# EAGLE design mega_shield_1_1 (EAGLE 7.5.0)
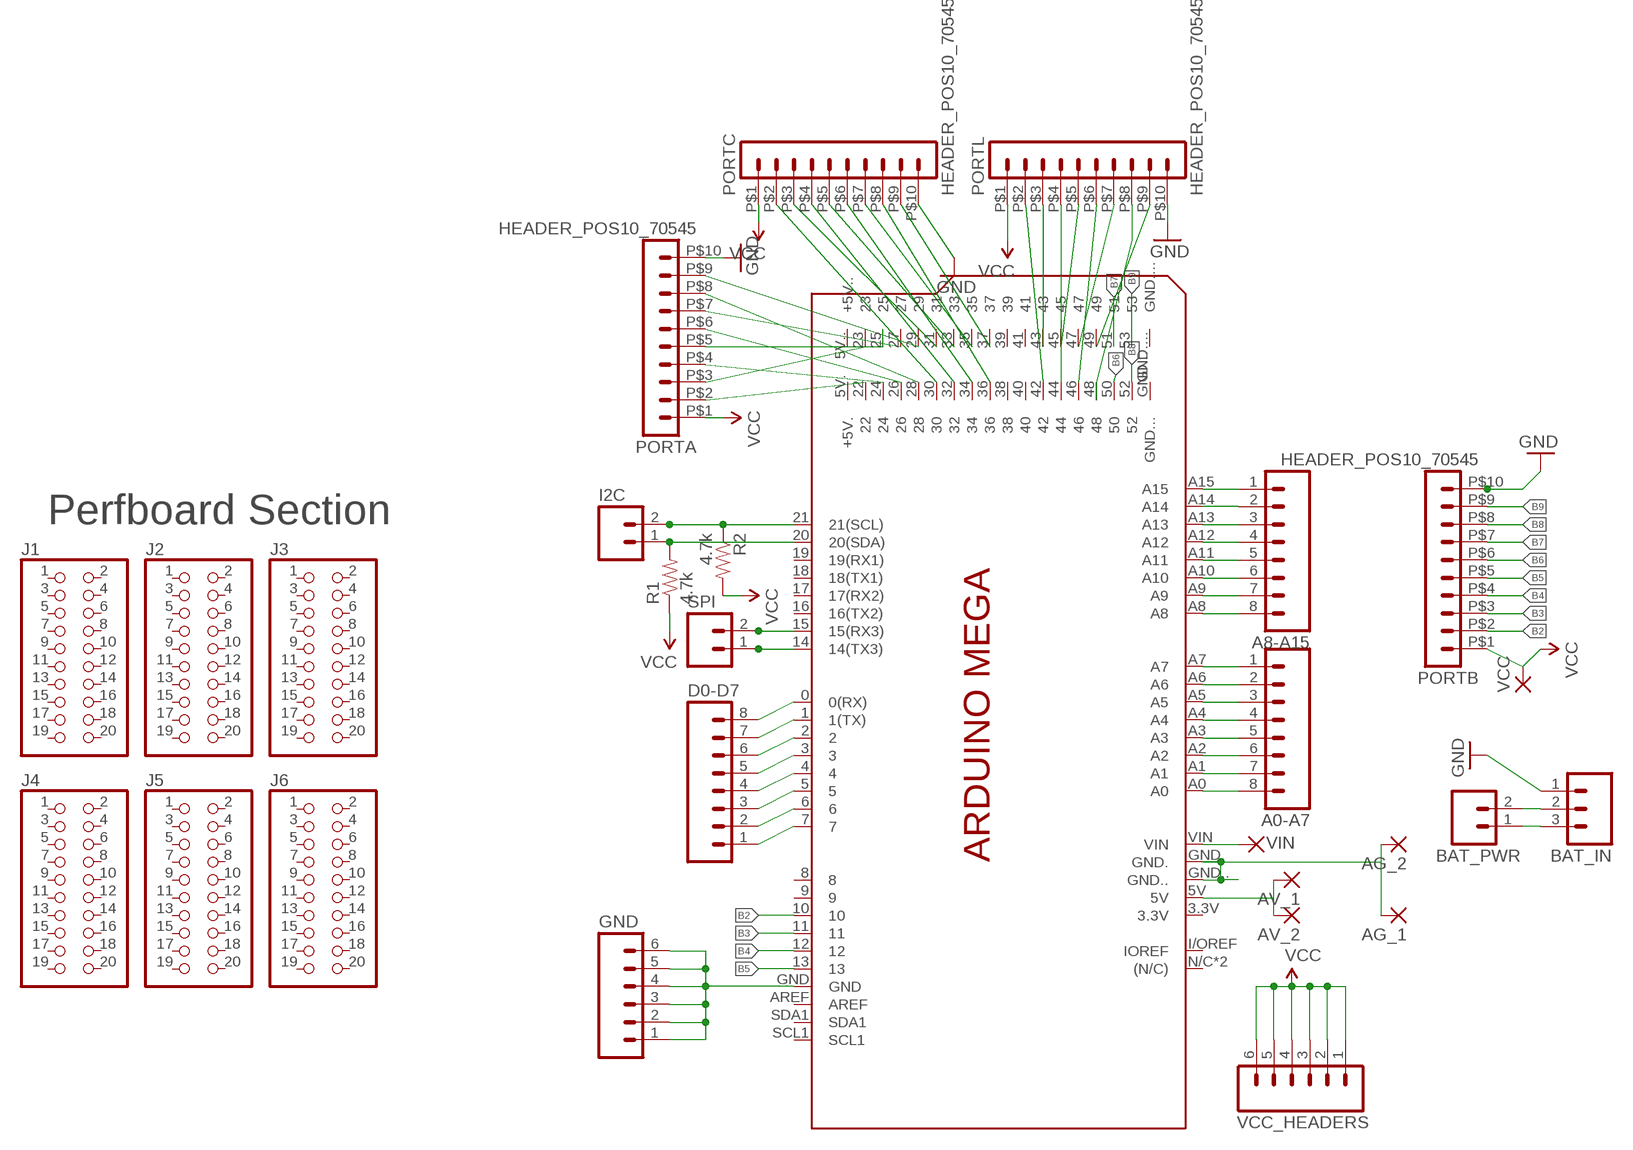
[diagram p0: schematic, sheet 1]

## Parts
A0-A7  M08  [1X08_ROUND]
A8-A15  M08  [1X08_ROUND]
AG_1  2,54/1,0  [2,54/1,0]
AG_2  2,54/1,0  [2,54/1,0]
AV_1  2,54/1,0  [2,54/1,0]
AV_2  2,54/1,0  [2,54/1,0]
BAT_IN  M03POLAR  [MOLEX-1X3]
BAT_PWR  M021X02_NO_SILK  [1X02_NO_SILK]
D0-D7  M08  [1X08_ROUND]
GND  M06SILK_FEMALE_PTH  [1X06]
I2C  M02PTH  [1X02]
J1  PINHD-2X10  [2X10]
J2  PINHD-2X10  [2X10]
J3  PINHD-2X10  [2X10]
J4  PINHD-2X10  [2X10]
J5  PINHD-2X10  [2X10]
J6  PINHD-2X10  [2X10]
PCB1  ARDUINO_MEGA  [ARDUINO_MEGA]
PORTA  HEADER_POS10_70545  [70545-POS10]
PORTB  HEADER_POS10_70545  [70545-POS10]
PORTC  HEADER_POS10_70545  [70545-POS10]
PORTL  HEADER_POS10_70545  [70545-POS10]
R1  4.7k  RESISTORPTH1  [AXIAL-0.3]
R2  4.7k  RESISTORPTH1  [AXIAL-0.3]
SPI  M02PTH  [1X02]
VCC  2,54/0,9  [2,54/0,9]
VCC_HEADERS  M06SILK_FEMALE_PTH  [1X06]
VIN  2,54/1,0  [2,54/1,0]

## Nets
B2: PCB1.10 PORTB.P$2
B3: PCB1.11 PORTB.P$3
B4: PCB1.12 PORTB.P$4
B5: PCB1.13 PORTB.P$5
B6: PCB1.50 PORTB.P$6
B7: PCB1.51 PORTB.P$7
B8: PCB1.52 PORTB.P$8
B9: PCB1.53 PORTB.P$9
GND: BAT_IN.1 PORTA.P$10 PORTB.P$10 PORTC.P$10 PORTL.P$10
GND_PI: AG_1.1(P) AG_2.1(P) PCB1.GND. PCB1.GND..
N$1: PCB1.22 PORTA.P$2
N$2: PCB1.23 PORTA.P$3
N$3: PCB1.24 PORTA.P$4
N$4: PCB1.25 PORTA.P$5
N$5: PCB1.26 PORTA.P$6
N$6: PCB1.27 PORTA.P$7
N$7: PCB1.28 PORTA.P$8
N$8: PCB1.29 PORTA.P$9
N$9: PCB1.14(14(TX3)) SPI.1
N$10: PCB1.15(15(RX3)) SPI.2
N$11: PCB1.30 PORTC.P$2
N$12: PCB1.31 PORTC.P$3
N$13: PCB1.32 PORTC.P$4
N$14: PCB1.33 PORTC.P$5
N$15: PCB1.34 PORTC.P$6
N$16: PCB1.35 PORTC.P$7
N$17: PCB1.36 PORTC.P$8
N$18: PCB1.37 PORTC.P$9
N$19: PCB1.42 PORTL.P$2
N$20: PCB1.43 PORTL.P$3
N$21: PCB1.44 PORTL.P$4
N$22: PCB1.45 PORTL.P$5
N$23: PCB1.46 PORTL.P$6
N$24: PCB1.47 PORTL.P$7
N$25: PCB1.49 PORTL.P$9
N$26: BAT_IN.2 BAT_PWR.2
N$27: A0-A7.1 PCB1.A7
N$28: A0-A7.2 PCB1.A6
N$29: PCB1.48 PORTL.P$8
N$30: A0-A7.3 PCB1.A5
N$31: A0-A7.4 PCB1.A4
N$32: A0-A7.5 PCB1.A3
N$33: A0-A7.6 PCB1.A2
N$34: A0-A7.7 PCB1.A1
N$35: I2C.1 PCB1.20(20(SDA)) R1.P$2
N$36: I2C.2 PCB1.21(21(SCL)) R2.P$1
N$37: A0-A7.8 PCB1.A0
N$38: A8-A15.8 PCB1.A8
N$39: A8-A15.7 PCB1.A9
N$40: A8-A15.6 PCB1.A10
N$41: A8-A15.5 PCB1.A11
N$42: A8-A15.4 PCB1.A12
N$43: A8-A15.3 PCB1.A13
N$44: A8-A15.2 PCB1.A14
N$45: A8-A15.1 PCB1.A15
N$46: D0-D7.1 PCB1.7
N$47: D0-D7.2 PCB1.6
N$48: D0-D7.3 PCB1.5
N$49: D0-D7.4 PCB1.4
N$50: D0-D7.5 PCB1.3
N$51: D0-D7.6 PCB1.2
N$52: D0-D7.7 PCB1.1(1(TX))
N$53: D0-D7.8 PCB1.0(0(RX))
N$54: GND.1 GND.2 GND.3 GND.4 GND.5 GND.6 PCB1.GND
N$55: AV_1.1(P) AV_2.1(P) PCB1.5V
N$56: BAT_IN.3 BAT_PWR.1
VCC: PORTA.P$1 PORTB.P$1 PORTC.P$1 PORTL.P$1 R1.P$1 R2.P$2 VCC.1(P) VCC_HEADERS.1 VCC_HEADERS.2 VCC_HEADERS.3 VCC_HEADERS.4 VCC_HEADERS.5 VCC_HEADERS.6
VIN: PCB1.VIN VIN.1(P)
Unconnected: J1.1 J1.2 J1.3 J1.4 J1.5 J1.6 J1.7 J1.8 J1.9 J1.10 J1.11 J1.12 J1.13 J1.14 J1.15 J1.16 J1.17 J1.18 J1.19 J1.20 J2.1 J2.2 J2.3 J2.4 J2.5 J2.6 J2.7 J2.8 J2.9 J2.10 J2.11 J2.12 J2.13 J2.14 J2.15 J2.16 J2.17 J2.18 J2.19 J2.20 J3.1 J3.2 J3.3 J3.4 J3.5 J3.6 J3.7 J3.8 J3.9 J3.10 J3.11 J3.12 J3.13 J3.14 J3.15 J3.16 J3.17 J3.18 J3.19 J3.20 J4.1 J4.2 J4.3 J4.4 J4.5 J4.6 J4.7 J4.8 J4.9 J4.10 J4.11 J4.12 J4.13 J4.14 J4.15 J4.16 J4.17 J4.18 J4.19 J4.20 J5.1 J5.2 J5.3 J5.4 J5.5 J5.6 J5.7 J5.8 J5.9 J5.10 J5.11 J5.12 J5.13 J5.14 J5.15 J5.16 J5.17 J5.18 J5.19 J5.20 J6.1 J6.2 J6.3 J6.4 J6.5 J6.6 J6.7 J6.8 J6.9 J6.10 J6.11 J6.12 J6.13 J6.14 J6.15 J6.16 J6.17 J6.18 J6.19 J6.20 PCB1.3.3V PCB1.5V.(+5V.) PCB1.5V..(+5V..) PCB1.8 PCB1.9 PCB1.16(16(TX2)) PCB1.17(17(RX2)) PCB1.18(18(TX1)) PCB1.19(19(RX1)) PCB1.38 PCB1.39 PCB1.40 PCB1.41 PCB1.AREF PCB1.GND... PCB1.GND.... PCB1.I/OREF(IOREF) PCB1.N/C((N/C)) PCB1.RESET((N/C)) PCB1.SCL1 PCB1.SDA1

## Notes on the sheet
- Perfboard Section

## Library data of the parts
A0-A7 A8-A15 D0-D7 = SparkFun-Connectors:M08: Header 8 Standard 8-pin 0.1" header. Use with straight break away headers (SKU : PRT-00116), right angle break away headers (PRT-00553), swiss pins (PRT-00743), machine pins (PRT-00117), and female headers (PRT-00115).; PROD_ID: CONN-08437
AG_1 AG_2 AV_1 AV_2 VIN = wirepad:2,54/1,0: THROUGH-HOLE PAD
BAT_IN = SparkFun-Connectors:M03: Header 3 Standard 3-pin 0.1" header. Use with straight break away headers (SKU : PRT-00116), right angle break away headers (PRT-00553), swiss pins (PRT-00743), machine pins (PRT-00117), and female headers (PRT-00115). Molex polarized connector foot print use with SKU : PRT-08232 with associated crimp pins and housings.
BAT_PWR = SparkFun-Connectors:M02: Standard 2-pin 0.1" header. Use with - straight break away headers ( PRT-00116) - right angle break away headers (PRT-00553) - swiss pins (PRT-00743) - machine pins (PRT-00117) - female headers (PRT-00115) Molex polarized connector foot print use with: PRT-08233 with associated crimp pins and housings. 2.54_SCREWTERM for use with PRT-10571. 3.5mm Screw Terminal footprints for PRT-08084 5mm Screw Terminal footprints for use with PRT-08432
GND VCC_HEADERS = SparkFun-Connectors:M06: Header 6 Standard 6-pin 0.1" header. Use with straight break away headers (SKU : PRT-00116), right angle break away headers (PRT-00553), swiss pins (PRT-00743), machine pins (PRT-00117), and female headers (PRT-00115). Molex polarized connector foot print use with SKU : PRT-08094 with associated crimp pins and housings. NOTES ON THE VARIANTS LOCK and LOCK_LONGPADS... This footprint was designed to help hold the alignment of a through-hole component (i.e. 6-pin header) while soldering it into place. You may notice that each hole has been shifted either up or down by 0.005 of an inch from it's more standard position (which is a perfectly straight line). This slight alteration caused the pins (the squares in the middle) to touch the edges of the holes. Because they are alternating, it causes a "brace" to hold the component in place. 0.005 has proven to be the perfect amount of "off-center" position when using our standard breakaway headers. Although looks a little odd when you look at the bare footprint, once you have a header in there, the alteration is very hard to notice. Also,if you push a header all the way into place, it is covered up entirely on the bottom side. This idea of altering the position of holes to aid alignment will be further integrated into the Sparkfun Library for other footprints. It can help hold any component with 3 or more connection pins.; PROD_ID: CONN-08437
I2C SPI = SparkFun:M02: Header 2 Standard 2-pin 0.1" header. Use with straight break away headers (SKU : PRT-00116), right angle break away headers (PRT-00553), swiss pins (PRT-00743), machine pins (PRT-00117), and female headers (PRT-00115). Molex polarized connector foot print use with SKU : PRT-08233 with associated crimp pins and housings.
J1-J6 = SparkFun-Connectors:PINHD-2X10: PIN HEADER
PCB1 = Nathans_Arduinos:ARDUINO_MEGA: Device for representing an Arduino Mega board with a footprint in an EAGLE design. Created by Dave Young for Element14. More EAGLE documentation at: http://www.element14.com/community/community/knode/cadsoft_eagle
PORTA PORTB PORTC PORTL = con-molex-c-grid-sl:HEADER_POS10_?: Molex -C-Grid® / SL Series connector Wire-to-Board 2.54 mm (0.100") pitch header, 10 positions.
R1 R2 = SparkFun:RESISTOR: Resistor Basic schematic elements and footprints for 0603, 1206, and PTH 1/10th watt (small) resistors.
VCC = wirepad:2,54/0,9: THROUGH-HOLE PAD

## Net classes
0 default: width 0.178 mm, drill 0.254 mm, clearance 0.178 mm
1 VCC: width 0.381 mm, drill 0.406 mm, clearance 0.305 mm

## Board
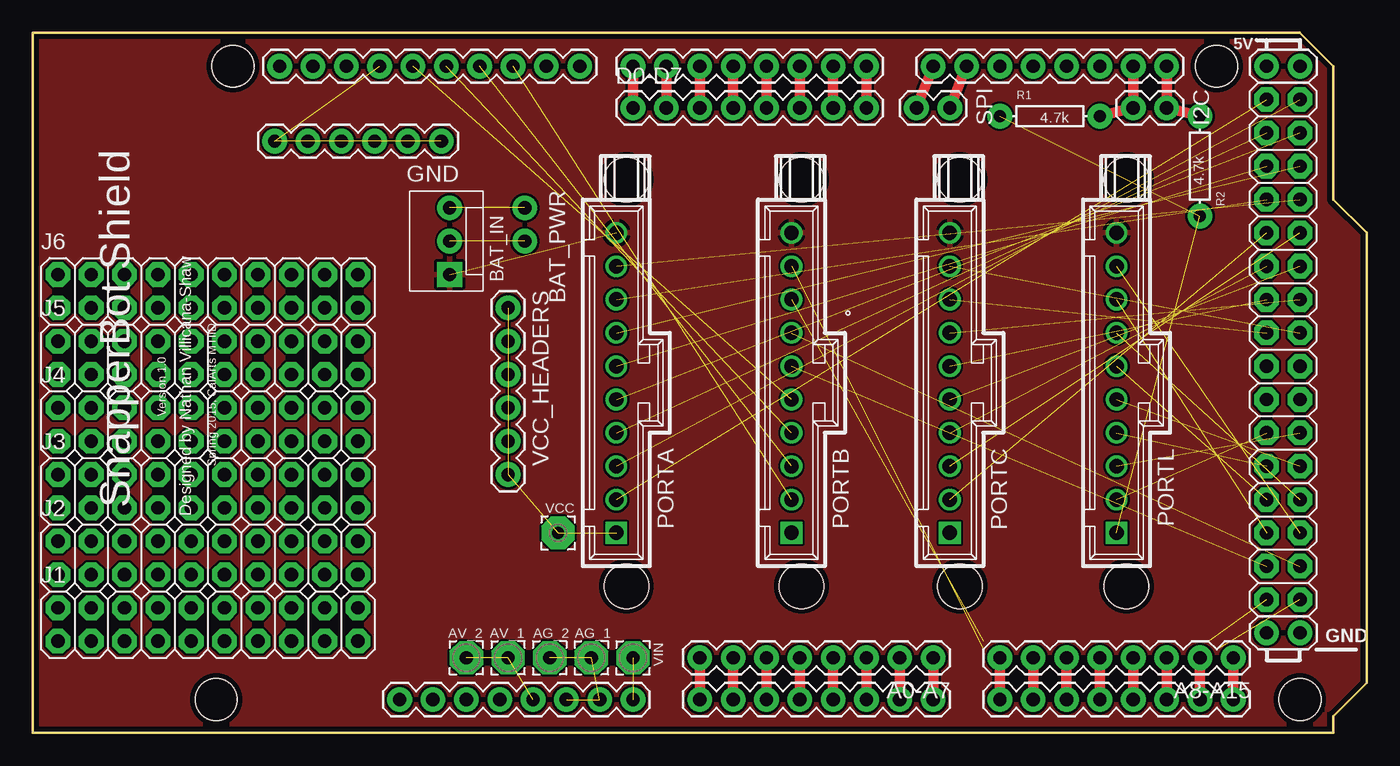
[diagram p1: board, top side]
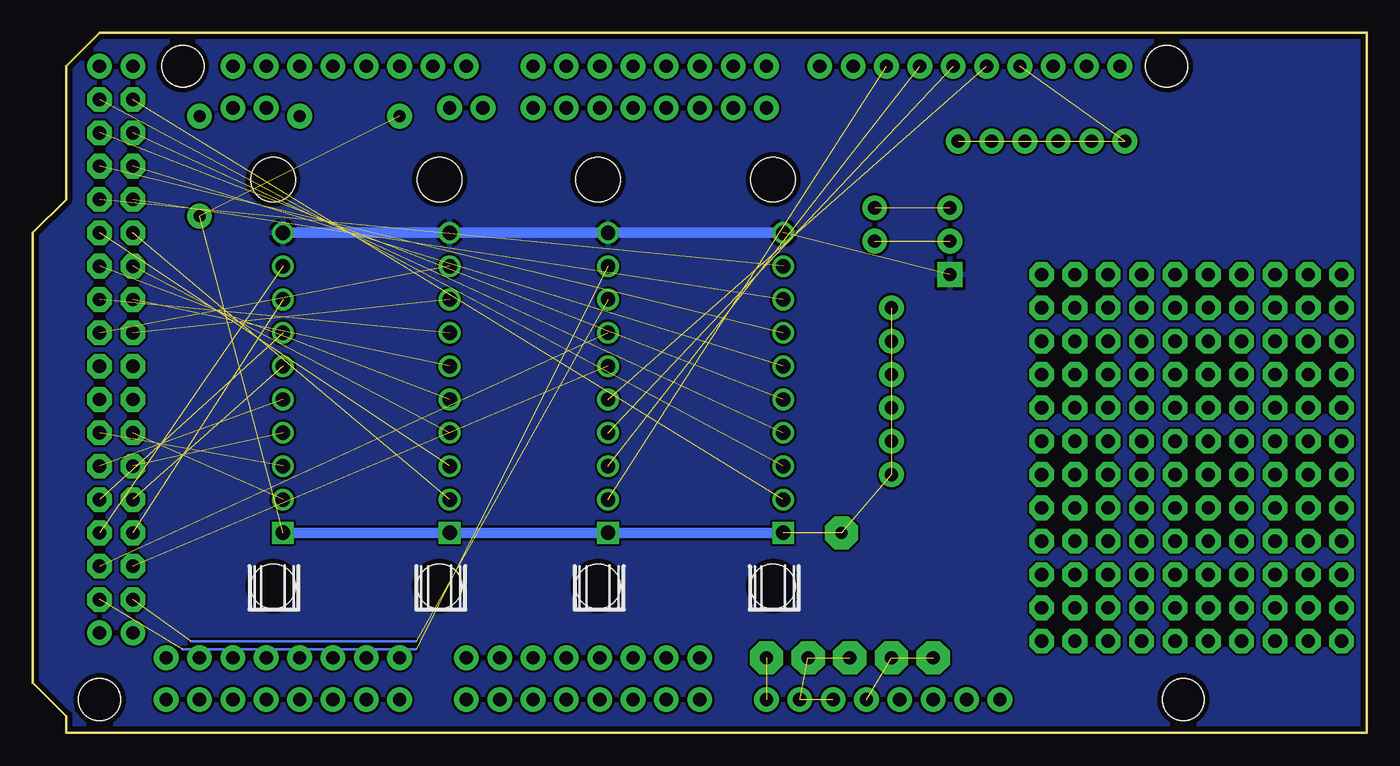
[diagram p2: board, bottom side, seen from below]

Size 101.6 x 53.34 mm. Coordinates in mm from the lower left corner, seen from the top.
Outline: 0,0 99.06,0 99.06,1.27 101.6,3.81 101.6,38.1 99.06,40.64 99.06,50.8 96.52,53.34 0,53.34 0,0
Copper layers (1*16): Top 0.0356mm / dielectric 1.5011mm / Bottom 0.0356mm
Design rules "oshPark": minimum track width 6mil, minimum drill 13mil, track to track 6mil, track to pad 6mil, pad to pad 6mil, via to via 6mil, smd to smd 6mil, copper to edge 15mil, drill to drill 6mil, minimum pad ring 7mil, minimum via ring 7mil, stop-mask expansion 3mil, vias tented up to drill 0mil, thermal gap 10mil

### Footprints (pad centres in the part's own frame; a part is rotated, then mirrored left to right if it is on the bottom)
1X08_ROUND = drill 1.016 pad 1.88: 1 0,0; 2 2.54,0; 3 5.08,0; 4 7.62,0; 5 10.16,0; 6 12.7,0; 7 15.24,0; 8 17.78,0
2,54/1,0 = drill 1.016 pad 2.54 octagon: 1 0,0
MOLEX-1X3 = drill 1.016 pad 1.88 square: 1 0,0 | drill 1.016 pad 1.88: 2 2.54,0; 3 5.08,0
1X02_NO_SILK = drill 1.016 pad 1.88: 1 0,0; 2 2.54,0
1X06 = drill 1.016 pad 1.88: 1 0,0; 2 2.54,0; 3 5.08,0; 4 7.62,0; 5 10.16,0; 6 12.7,0
1X02 = drill 1.016 pad 1.88: 1 0,0; 2 2.54,0
2X10 = drill 1.016 pad 1.88 octagon: 1 -11.43,-1.27; 2 -11.43,1.27; 3 -8.89,-1.27; 4 -8.89,1.27; 5 -6.35,-1.27; 6 -6.35,1.27; 7 -3.81,-1.27; 8 -3.81,1.27; 9 -1.27,-1.27; 10 -1.27,1.27; 11 1.27,-1.27; 12 1.27,1.27; 13 3.81,-1.27; 14 3.81,1.27; 15 6.35,-1.27; 16 6.35,1.27; 17 8.89,-1.27; 18 8.89,1.27; 19 11.43,-1.27; 20 11.43,1.27
ARDUINO_MEGA = drill 1.016 pad 1.88: 0 63.5,50.8; 1 60.96,50.8; 2 58.42,50.8; 3 55.88,50.8; 3.3V 35.56,2.54; 4 53.34,50.8; 5 50.8,50.8; 5V 38.1,2.54; 5V. 93.98,50.8; 5V.. 96.52,50.8; 6 48.26,50.8; 7 45.72,50.8; 8 41.656,50.8; 9 39.116,50.8; 10 36.576,50.8; 11 34.036,50.8; 12 31.496,50.8; 13 28.956,50.8; 14 68.58,50.8; 15 71.12,50.8; 16 73.66,50.8; 17 76.2,50.8; 18 78.74,50.8; 19 81.28,50.8; 20 83.82,50.8; 21 86.36,50.8; A0 50.8,2.54; A1 53.34,2.54; A2 55.88,2.54; A3 58.42,2.54; A4 60.96,2.54; A5 63.5,2.54; A6 66.04,2.54; A7 68.58,2.54; A8 73.66,2.54; A9 76.2,2.54; A10 78.74,2.54; A11 81.28,2.54; A12 83.82,2.54; A13 86.36,2.54; A14 88.9,2.54; A15 91.44,2.54; AREF 23.876,50.8; GND 26.416,50.8; GND. 43.18,2.54; GND.. 40.64,2.54; GND... 93.98,7.62; GND.... 96.52,7.62; I/OREF 30.48,2.54; N/C 27.94,2.54; RESET 33.02,2.54; SCL1 18.796,50.8; SDA1 21.336,50.8; VIN 45.72,2.54 | drill 1.016 pad 1.88 octagon: 22 93.98,48.26; 23 96.52,48.26; 24 93.98,45.72; 25 96.52,45.72; 26 93.98,43.18; 27 96.52,43.18; 28 93.98,40.64; 29 96.52,40.64; 30 93.98,38.1; 31 96.52,38.1; 32 93.98,35.56; 33 96.52,35.56; 34 93.98,33.02; 35 96.52,33.02; 36 93.98,30.48; 37 96.52,30.48; 38 93.98,27.94; 39 96.52,27.94; 40 93.98,25.4; 41 96.52,25.4; 42 93.98,22.86; 43 96.52,22.86; 44 93.98,20.32; 45 96.52,20.32; 46 93.98,17.78; 47 96.52,17.78; 48 93.98,15.24; 49 96.52,15.24; 50 93.98,12.7; 51 96.52,12.7; 52 93.98,10.16; 53 96.52,10.16 | hole 3.2: 15.24,50.8; 13.97,2.54; 90.17,50.8; 96.52,2.54
70545-POS10 = drill 1.1 square: P$1 11.43,0 | drill 1.1: P$2 8.89,0; P$3 6.35,0; P$4 3.81,0; P$5 1.27,0; P$6 -1.27,0; P$7 -3.81,0; P$8 -6.35,0; P$9 -8.89,0; P$10 -11.43,0 | hole 3.404: -15.494,0.762; 15.494,0.762
AXIAL-0.3 = drill 0.9 pad 1.88: P$1 -3.81,0; P$2 3.81,0
2,54/0,9 = drill 0.914 pad 2.54 octagon: 1 0,0

### Placement (x,y rotation side)
A0-A7  68.58,5.71 180 top
A8-A15  91.44,5.71 180 top
AG_1  42.55,5.71 270 top
AG_2  39.37,5.71 270 top
AV_1  36.2,5.71 90 top
AV_2  33.02,5.71 90 top
BAT_IN  31.75,34.92 90 top
BAT_PWR  37.47,40.01 270 top
D0-D7  45.72,47.62 0 top
GND  31.11,45.09 180 top
I2C  83.82,47.62 0 top
J1  13.34,8.26 0 top
J2  13.34,13.34 0 top
J3  13.34,18.41 0 top
J4  13.34,23.5 0 top
J5  13.34,28.57 0 top
J6  13.34,33.66 0 top
PCB1  0,0 0 top
PORTA  44.45,26.67 270 top
PORTB  57.78,26.67 270 top
PORTC  69.85,26.67 270 top
PORTL  82.55,26.67 270 top
R1  77.47,46.99 0 top
R2  88.9,43.18 270 top
SPI  67.31,47.62 0 top
VCC  40.01,15.24 90 top
VCC_HEADERS  36.2,32.38 270 top
VIN  45.72,5.71 0 top

### Tracks (layer width: path | path; a pad name or v marks a point on that pad's centre or on a via)
B2  (1 unrouted)
B3  (1 unrouted)
B4  (1 unrouted)
B5  (1 unrouted)
B6  (1 unrouted)
B7  (1 unrouted)
B8  (2 unrouted)
  Bottom 0.203: 89.53,6.99 72.39,6.99
B9  (2 unrouted)
  Bottom 0.203: 90.17,6.35 72.39,6.35
GND  (1 unrouted)
  Bottom 0.813: PORTA.P$10 PORTB.P$10 PORTC.P$10 PORTL.P$10
  pour Top: 0,0 0,53.34 96.52,53.34 99.06,50.8 99.06,40.64 101.6,38.1 101.6,3.81 99.06,1.27 99.06,0
  pour Bottom: 0,53.34 96.52,53.34 99.06,50.8 99.06,40.64 101.6,38.1 101.6,3.81 99.06,1.27 99.06,0 0,0
GND_PI  (3 unrouted)
N$1  (1 unrouted)
N$2  (1 unrouted)
N$3  (1 unrouted)
N$4  (1 unrouted)
N$5  (1 unrouted)
N$6  (1 unrouted)
N$7  (1 unrouted)
N$8  (1 unrouted)
N$9
  Top 0.813: PCB1.14 SPI.1
N$10
  Top 0.813: PCB1.15 SPI.2
N$11  (1 unrouted)
N$12  (1 unrouted)
N$13  (1 unrouted)
N$14  (1 unrouted)
N$15  (1 unrouted)
N$16  (1 unrouted)
N$17  (1 unrouted)
N$18  (1 unrouted)
N$19  (1 unrouted)
N$20  (1 unrouted)
N$21  (1 unrouted)
N$22  (1 unrouted)
N$23  (1 unrouted)
N$24  (1 unrouted)
N$25  (1 unrouted)
N$26  (1 unrouted)
N$27
  Top 0.813: PCB1.A7 A0-A7.1
N$28
  Top 0.813: PCB1.A6 A0-A7.2
N$29  (1 unrouted)
N$30
  Top 0.813: PCB1.A5 A0-A7.3
N$31
  Top 0.813: PCB1.A4 A0-A7.4
N$32
  Top 0.813: PCB1.A3 A0-A7.5
N$33
  Top 0.813: PCB1.A2 A0-A7.6
N$34
  Top 0.813: A0-A7.7 PCB1.A1
N$35
  Top 0.813: R1.P$2 I2C.1 PCB1.20
N$36
  Top 0.813: PCB1.21 I2C.2 R2.P$1
N$37
  Top 0.813: PCB1.A0 A0-A7.8
N$38
  Top 0.813: PCB1.A8 A8-A15.8
N$39
  Top 0.813: PCB1.A9 A8-A15.7
N$40
  Top 0.813: PCB1.A10 A8-A15.6
N$41
  Top 0.813: A8-A15.5 PCB1.A11
N$42
  Top 0.813: PCB1.A12 A8-A15.4
N$43
  Top 0.813: A8-A15.3 PCB1.A13
N$44
  Top 0.813: PCB1.A14 A8-A15.2
N$45
  Top 0.813: PCB1.A15 A8-A15.1
N$46
  Top 0.813: D0-D7.1 PCB1.7
N$47
  Top 0.813: PCB1.6 D0-D7.2
N$48
  Top 0.813: PCB1.5 D0-D7.3
N$49
  Top 0.813: PCB1.4 D0-D7.4
N$50
  Top 0.813: PCB1.3 D0-D7.5
N$51
  Top 0.813: PCB1.2 D0-D7.6
N$52
  Top 0.813: PCB1.1 D0-D7.7
N$53
  Top 0.813: PCB1.0 D0-D7.8
N$54  (6 unrouted)
N$55  (2 unrouted)
N$56  (1 unrouted)
VCC  (9 unrouted)
  Bottom 0.813: PORTA.P$1 PORTB.P$1 PORTC.P$1 PORTL.P$1
VIN  (1 unrouted)

### Text on the board
_tsilk: SnapperBot Shield | Version 1.0 | Spring 2015, CalArts MTIID | Designed by Nathan Villicana-Shaw